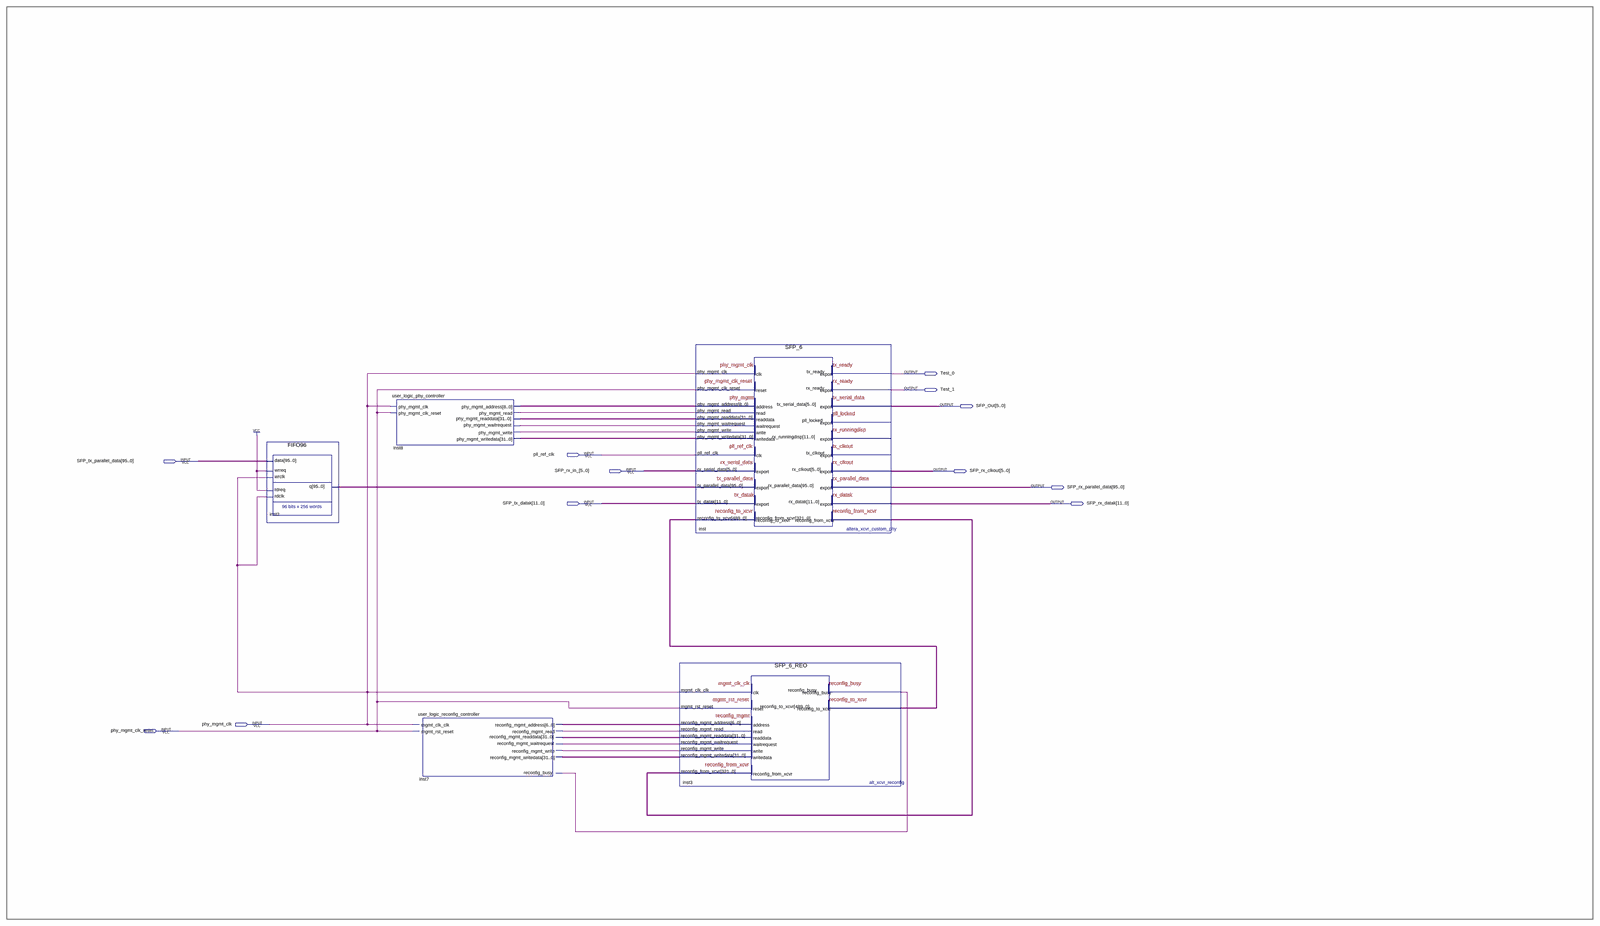
[diagram p0: schematic sheet, whole]
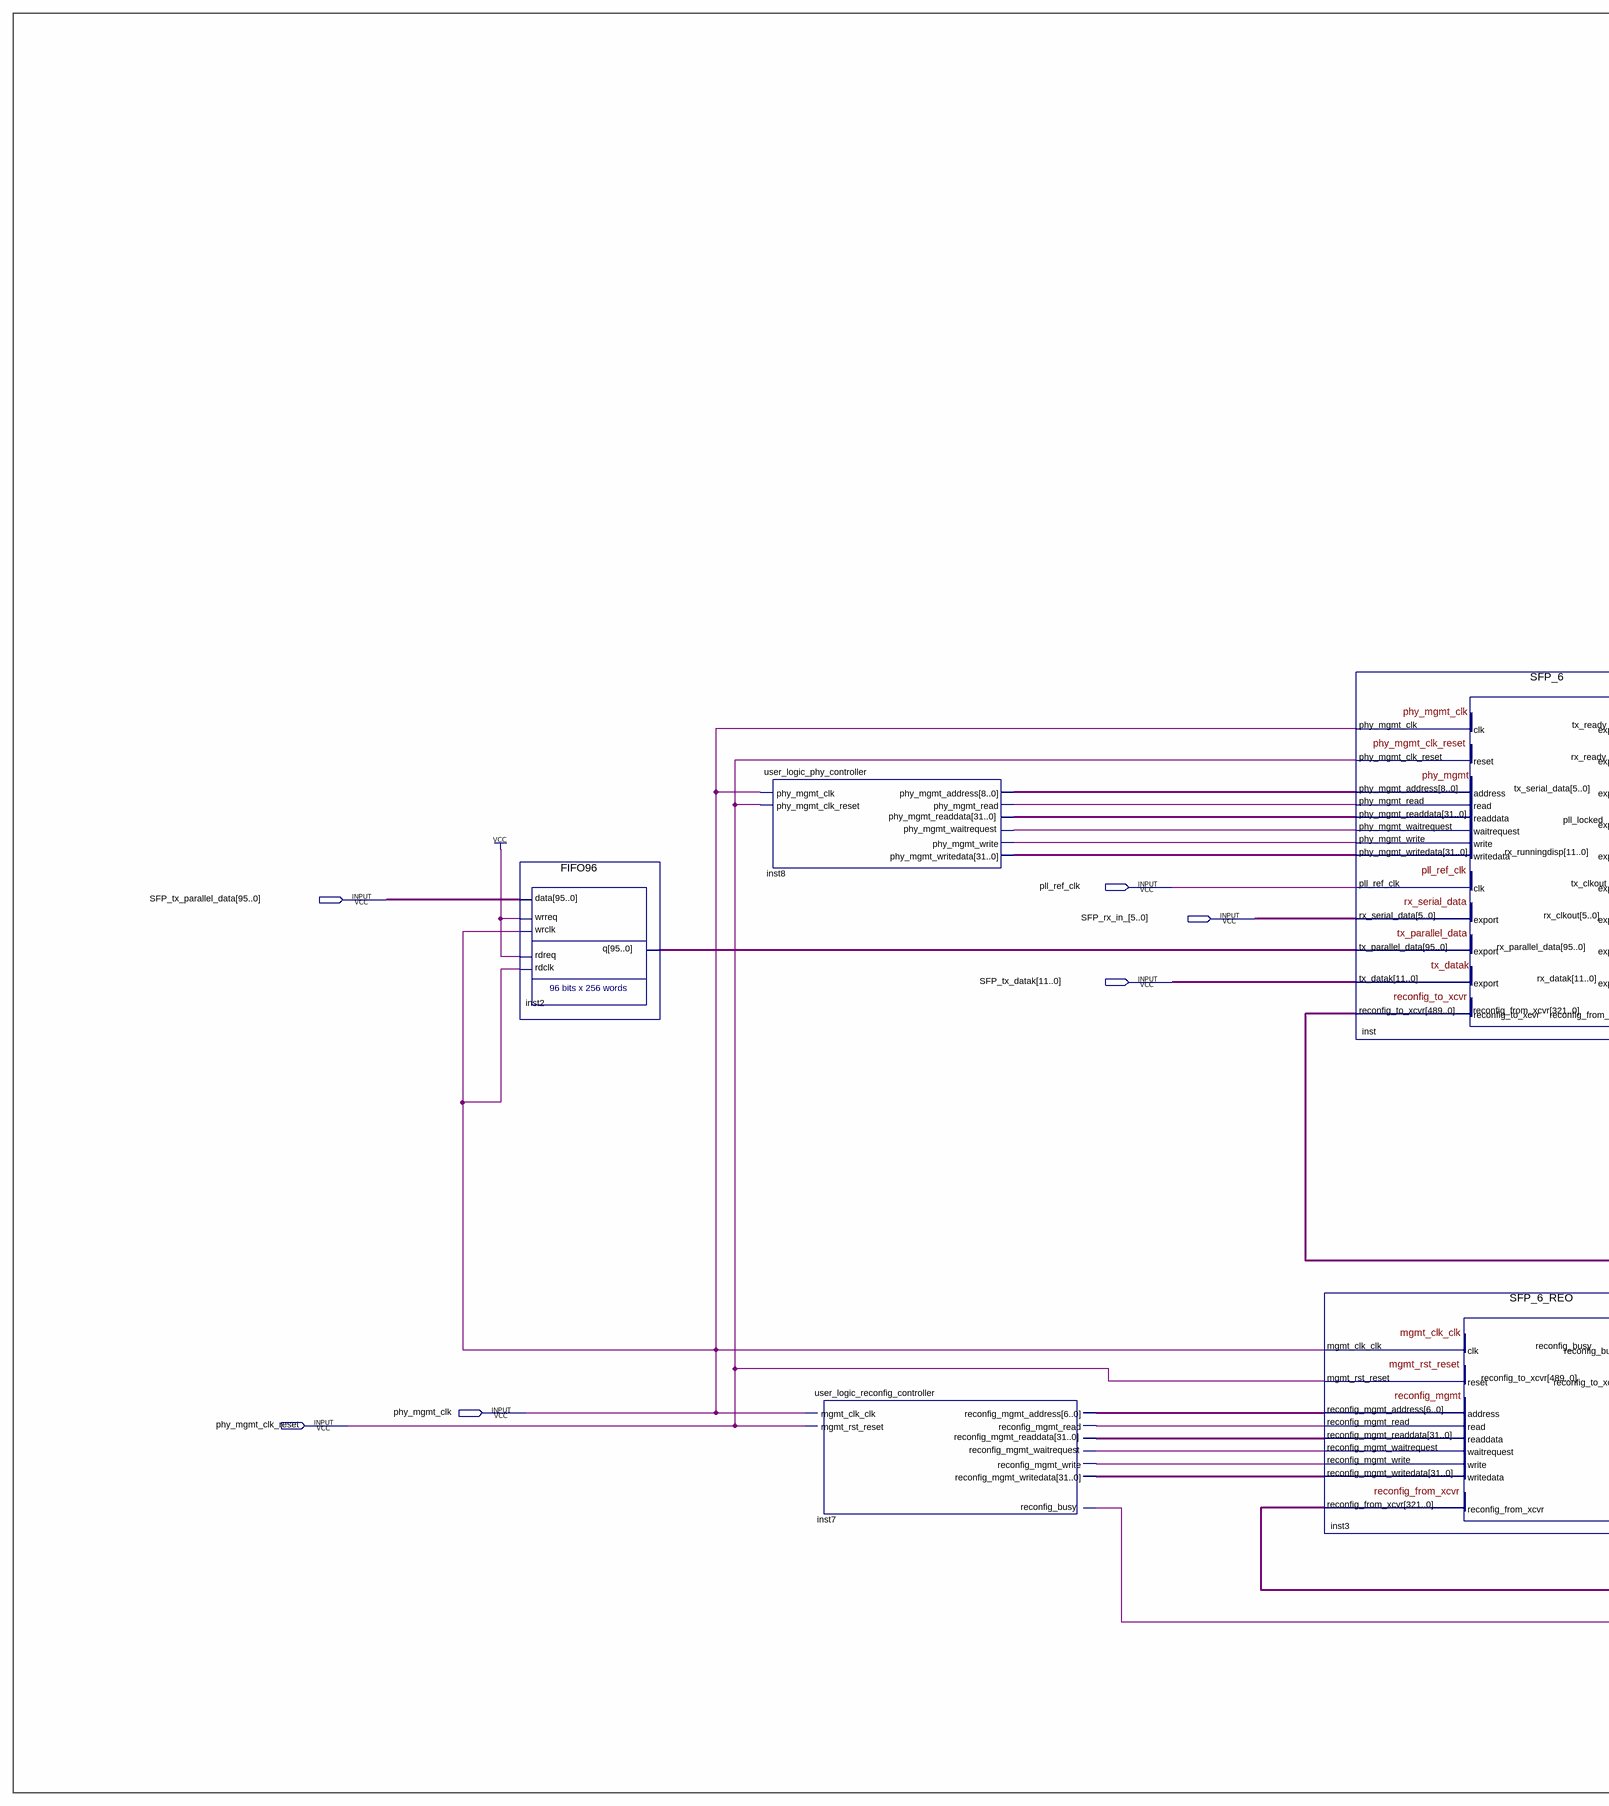
[diagram p1: schematic sheet, left part]
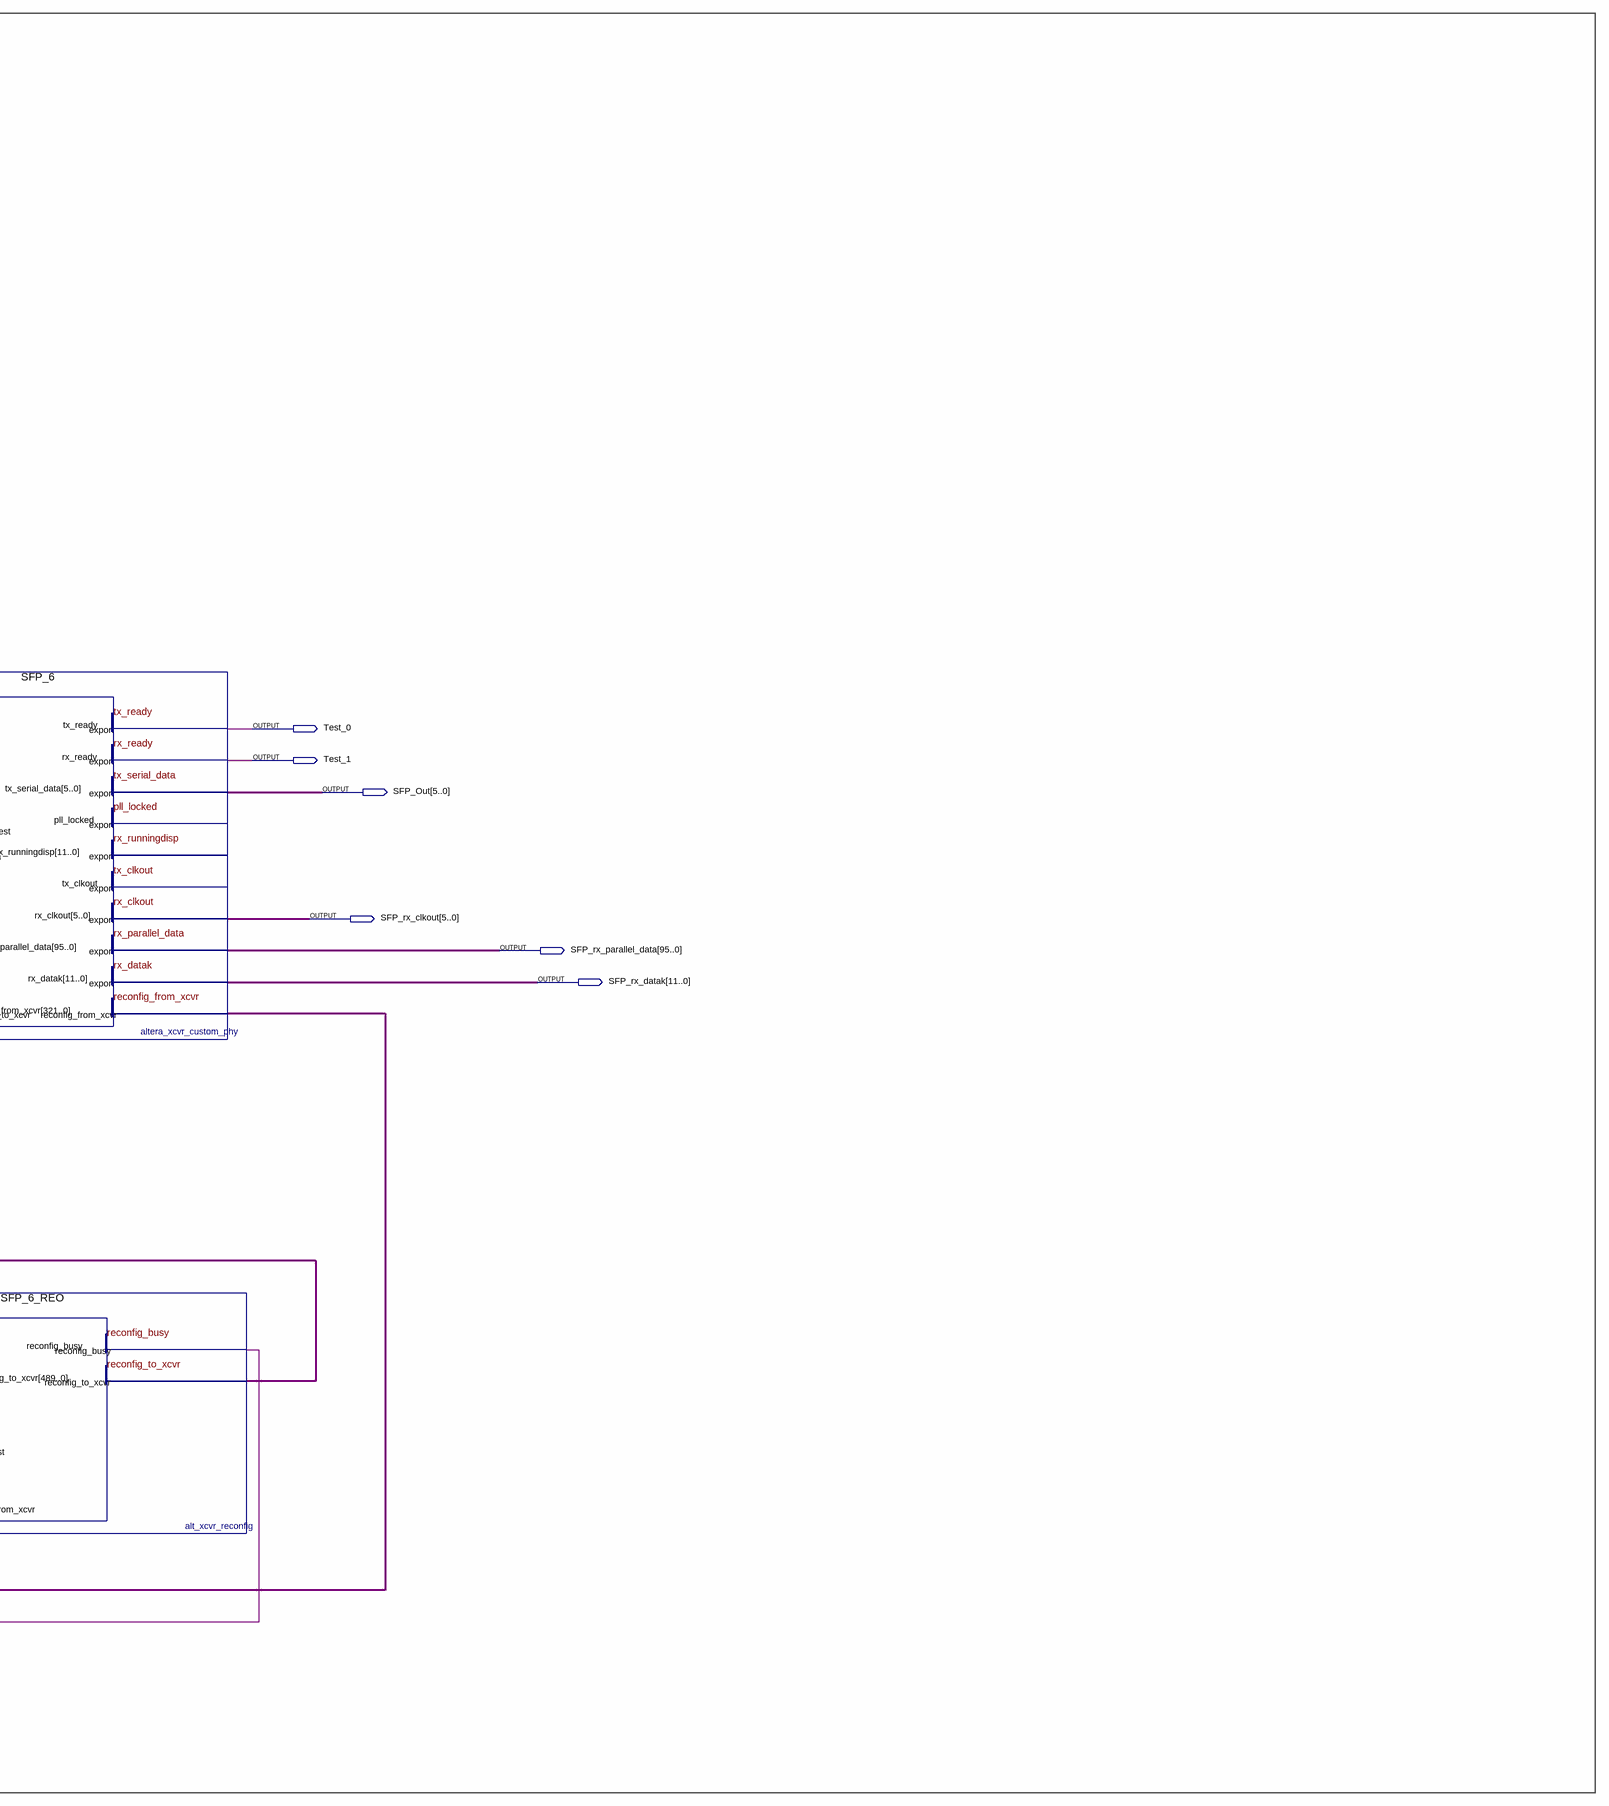
[diagram p2: schematic sheet, right part]
// Quartus schematic SFP_GxBlock_x6.bdf as structural Verilog: 5 symbols, 12 pins
module SFP_GxBlock_x6 (
  input  pll_ref_clk,
  input  [95:0] SFP_tx_parallel_data,
  input  [5:0] SFP_rx_in_,
  input  [11:0] SFP_tx_datak,
  input  phy_mgmt_clk,
  input  phy_mgmt_clk_reset,
  output Test_0,
  output Test_1,
  output [5:0] SFP_Out,
  output [5:0] SFP_rx_clkout,
  output [95:0] SFP_rx_parallel_data,
  output [11:0] SFP_rx_datak
);

  wire inst3_reconfig_busy, inst3_reconfig_mgmt_waitrequest, inst7_reconfig_mgmt_read,
       inst7_reconfig_mgmt_write, inst8_phy_mgmt_read, inst8_phy_mgmt_write, inst_phy_mgmt_waitrequest;
  wire [6:0] inst7_reconfig_mgmt_address;
  wire [8:0] inst8_phy_mgmt_address;
  wire [31:0] inst3_reconfig_mgmt_readdata, inst7_reconfig_mgmt_writedata, inst8_phy_mgmt_writedata,
       inst_phy_mgmt_readdata;
  wire [95:0] inst2_q;
  wire [321:0] inst_reconfig_from_xcvr;
  wire [489:0] inst3_reconfig_to_xcvr;

  FIFO96 inst2 (
    .data(SFP_tx_parallel_data), .wrreq(1'b1), .wrclk(phy_mgmt_clk), .rdreq(1'b1), .rdclk(phy_mgmt_clk),
    .q(inst2_q));
  user_logic_phy_controller inst8 (
    .phy_mgmt_clk(phy_mgmt_clk), .phy_mgmt_clk_reset(phy_mgmt_clk_reset),
    .phy_mgmt_readdata(inst_phy_mgmt_readdata), .phy_mgmt_waitrequest(inst_phy_mgmt_waitrequest),
    .phy_mgmt_address(inst8_phy_mgmt_address), .phy_mgmt_read(inst8_phy_mgmt_read),
    .phy_mgmt_write(inst8_phy_mgmt_write), .phy_mgmt_writedata(inst8_phy_mgmt_writedata));
  user_logic_reconfig_controller inst7 (
    .reconfig_busy(inst3_reconfig_busy), .mgmt_clk_clk(phy_mgmt_clk), .mgmt_rst_reset(phy_mgmt_clk_reset),
    .reconfig_mgmt_readdata(inst3_reconfig_mgmt_readdata),
    .reconfig_mgmt_waitrequest(inst3_reconfig_mgmt_waitrequest),
    .reconfig_mgmt_address(inst7_reconfig_mgmt_address), .reconfig_mgmt_read(inst7_reconfig_mgmt_read),
    .reconfig_mgmt_write(inst7_reconfig_mgmt_write), .reconfig_mgmt_writedata(inst7_reconfig_mgmt_writedata));
  SFP_6 inst (
    .phy_mgmt_clk(phy_mgmt_clk), .phy_mgmt_clk_reset(phy_mgmt_clk_reset),
    .phy_mgmt_address(inst8_phy_mgmt_address), .phy_mgmt_read(inst8_phy_mgmt_read),
    .phy_mgmt_write(inst8_phy_mgmt_write), .phy_mgmt_writedata(inst8_phy_mgmt_writedata),
    .pll_ref_clk(pll_ref_clk), .rx_serial_data(SFP_rx_in_), .tx_parallel_data(inst2_q),
    .tx_datak(SFP_tx_datak), .reconfig_to_xcvr(inst3_reconfig_to_xcvr),
    .phy_mgmt_readdata(inst_phy_mgmt_readdata), .phy_mgmt_waitrequest(inst_phy_mgmt_waitrequest),
    .tx_ready(Test_0), .rx_ready(Test_1), .tx_serial_data(SFP_Out), .rx_clkout(SFP_rx_clkout),
    .rx_parallel_data(SFP_rx_parallel_data), .rx_datak(SFP_rx_datak),
    .reconfig_from_xcvr(inst_reconfig_from_xcvr));  // open: pll_locked, rx_runningdisp, tx_clkout
  SFP_6_REO inst3 (
    .mgmt_clk_clk(phy_mgmt_clk), .mgmt_rst_reset(phy_mgmt_clk_reset),
    .reconfig_mgmt_address(inst7_reconfig_mgmt_address), .reconfig_mgmt_read(inst7_reconfig_mgmt_read),
    .reconfig_mgmt_write(inst7_reconfig_mgmt_write), .reconfig_mgmt_writedata(inst7_reconfig_mgmt_writedata),
    .reconfig_from_xcvr(inst_reconfig_from_xcvr), .reconfig_busy(inst3_reconfig_busy),
    .reconfig_mgmt_readdata(inst3_reconfig_mgmt_readdata),
    .reconfig_mgmt_waitrequest(inst3_reconfig_mgmt_waitrequest), .reconfig_to_xcvr(inst3_reconfig_to_xcvr));
endmodule
